# EAGLE design rak833-hat (EAGLE 9.0.1)
PROJECT_AUTHOR: XOSE PEREZ <xose.perez@gmail.com>; PROJECT_LICENSE: CC-SA-BY 4.0; PROJECT_NAME: RAK833 HAT; PROJECT_VERSION: 0.2.20180703
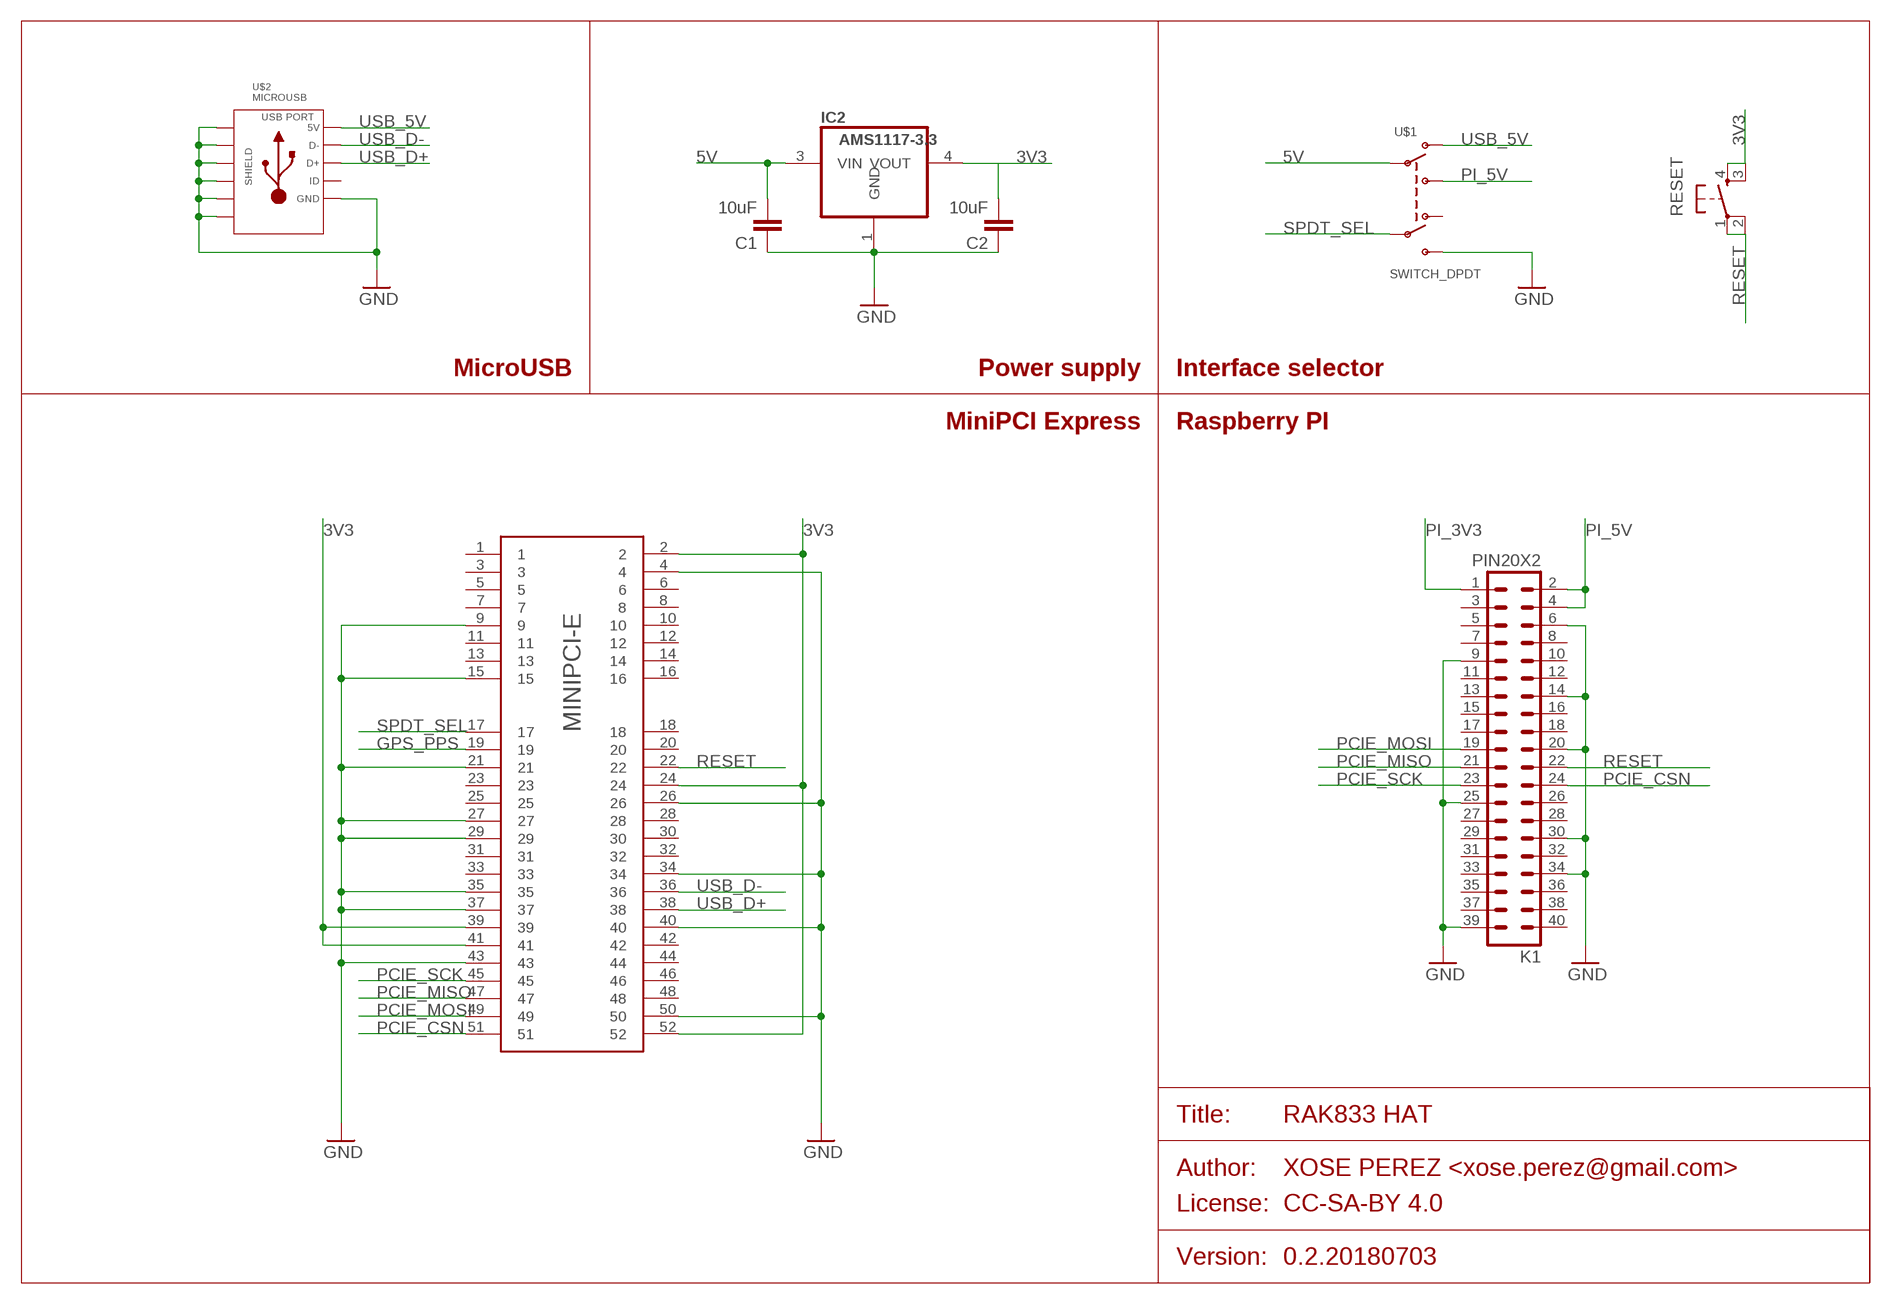
[diagram p0: schematic, sheet 1]

## Parts
C1  10uF  C-EU0805  [0805]
C2  10uF  C-EU0805  [0805]
IC2  AMS1117-3.3  REG1117SOT223-2  [SOT223]
K1  PIN20X2  [PIN_20X2]
MINIPCI-E  MINI-PCIE-RAW  [67910-MINI-PCIE]
RESET  TACTILE_BUTTON_SMD  [TACTILE-BUTTON-SMD]
U$1  SWITCH_DPDT  [SWITCH_DPDT_SMD]
U$2  MICROUSB  [MICROUSB-MOLEX-47346-0001]

## Nets
3V3: C2.2 IC2.4(VOUT) MINIPCI-E.2 MINIPCI-E.24 MINIPCI-E.39 MINIPCI-E.41 MINIPCI-E.52 RESET.3(SWB2) RESET.4(SWA2)
5V: C1.2 IC2.3(VIN) U$1.A1(P1)
GND: C1.1 C2.1 IC2.1(GND) K1.6 K1.9 K1.14 K1.20 K1.25 K1.30 K1.34 K1.39 MINIPCI-E.4 MINIPCI-E.9 MINIPCI-E.15 MINIPCI-E.21 MINIPCI-E.26 MINIPCI-E.27 MINIPCI-E.29 MINIPCI-E.34 MINIPCI-E.35 MINIPCI-E.37 MINIPCI-E.40 MINIPCI-E.43 MINIPCI-E.50 U$1.C2(S2) U$2.GND U$2.SLD1 U$2.SLD2 U$2.SLD3 U$2.SLD4 U$2.SLD5 U$2.SLD6
GPS_PPS: MINIPCI-E.19
PCIE_CSN: K1.24 MINIPCI-E.51
PCIE_MISO: K1.21 MINIPCI-E.47
PCIE_MOSI: K1.19 MINIPCI-E.49
PCIE_SCK: K1.23 MINIPCI-E.45
PI_3V3: K1.1
PI_5V: K1.2 K1.4 U$1.C1(S1)
RESET: K1.22 MINIPCI-E.22 RESET.1(SWA1) RESET.2(SWB1)
SPDT_SEL: MINIPCI-E.17 U$1.A2(P2)
USB_5V: U$1.B1(O1) U$2.VCC(5V)
USB_D+: MINIPCI-E.38 U$2.D+
USB_D-: MINIPCI-E.36 U$2.D-
Unconnected: K1.3 K1.5 K1.7 K1.8 K1.10 K1.11 K1.12 K1.13 K1.15 K1.16 K1.17 K1.18 K1.26 K1.27 K1.28 K1.29 K1.31 K1.32 K1.33 K1.35 K1.36 K1.37 K1.38 K1.40 MINIPCI-E.1 MINIPCI-E.3 MINIPCI-E.5 MINIPCI-E.6 MINIPCI-E.7 MINIPCI-E.8 MINIPCI-E.10 MINIPCI-E.11 MINIPCI-E.12 MINIPCI-E.13 MINIPCI-E.14 MINIPCI-E.16 MINIPCI-E.18 MINIPCI-E.20 MINIPCI-E.23 MINIPCI-E.25 MINIPCI-E.28 MINIPCI-E.30 MINIPCI-E.31 MINIPCI-E.32 MINIPCI-E.33 MINIPCI-E.42 MINIPCI-E.44 MINIPCI-E.46 MINIPCI-E.48 U$1.B2(O2) U$2.ID

## Notes on the sheet
- MicroUSB | Power supply | Interface selector
- MiniPCI Express | Raspberry PI

## Library data of the parts
C1 C2 = xose:C-EU: CAPACITOR, European symbol
IC2 = xose:REG1117: 800mA and 1A Low Dropout (LDO) Positive Regulator 1.8V, 2.5V, 2.85V, 3.3V, 5V, and Adj
K1 = FLYFISH:PIN20X2
MINIPCI-E = jt-con-molex:MINI-PCIE: Mini PCI-E card
RESET = xose:TACTILE_BUTTON: Tactile Button SparkFun Electronics' Tactile Button COM-10302
U$1 = xose:SWITCH_DPDT
U$2 = xose:MICROUSB

## Board
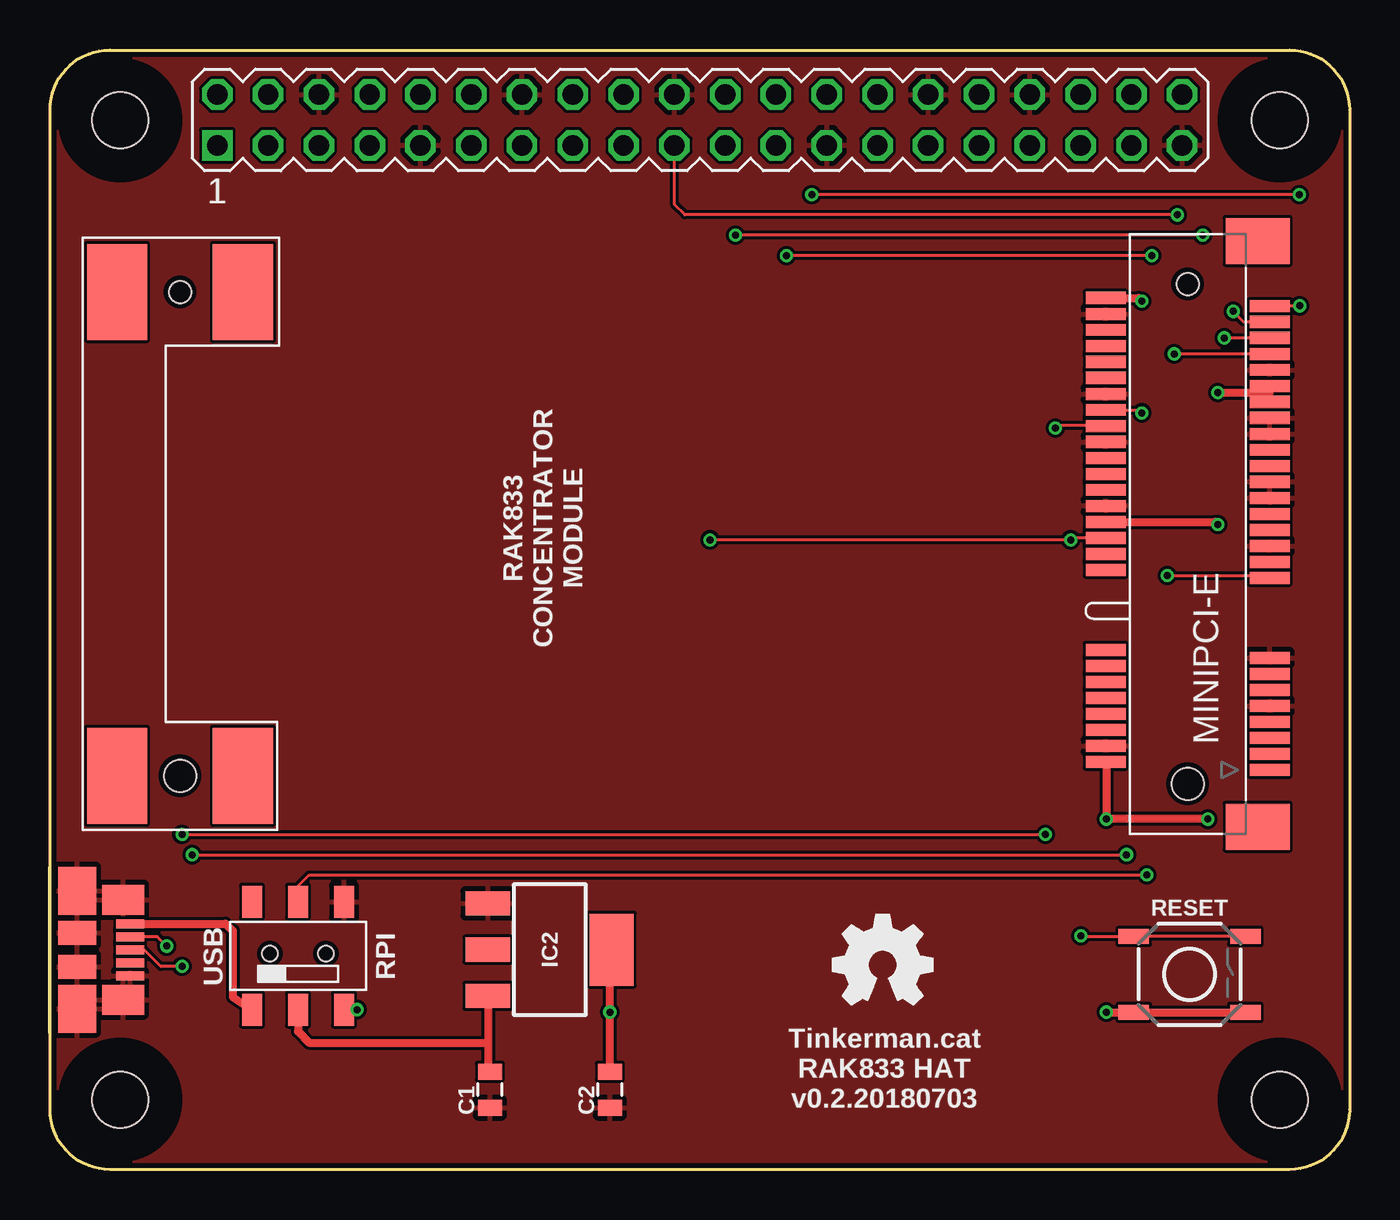
[diagram p1: board, top side]
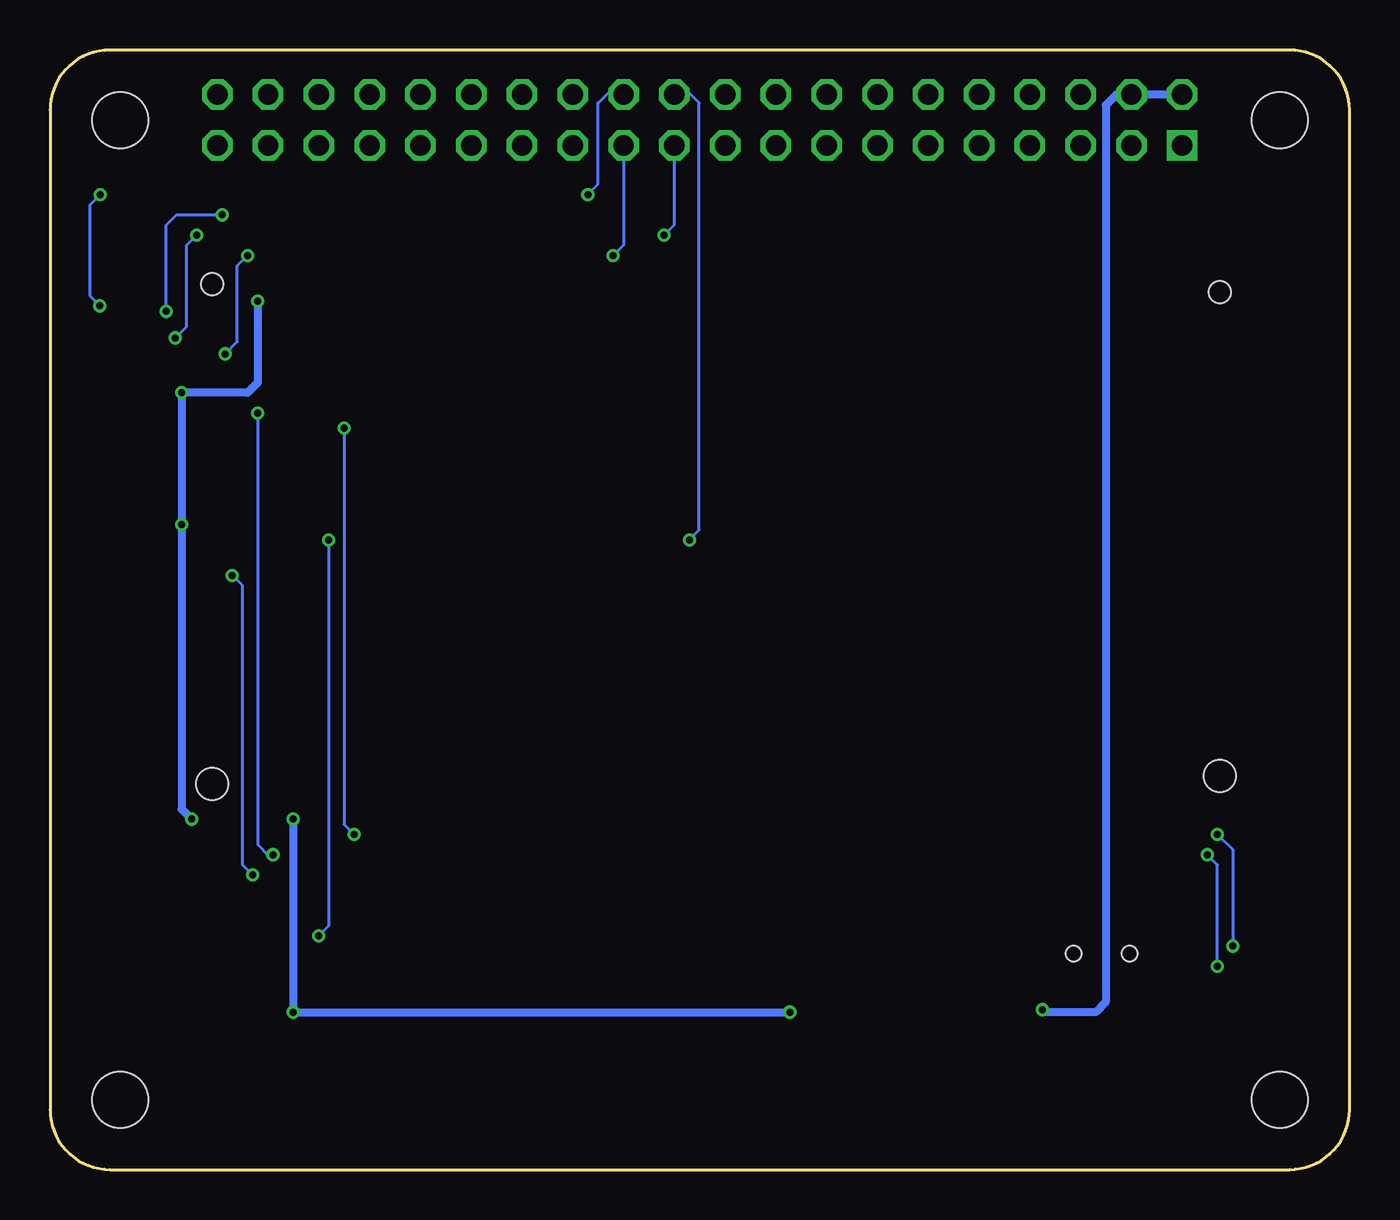
[diagram p2: board, bottom side, seen from below]

Size 65 x 56 mm. Coordinates in mm from the lower left corner, seen from the top.
Outline: 0,3 0,53 arc-90 3,56 62,56 arc-90 65,53 65,3 arc-90 62,0 3,0 arc-90 0,3
Copper layers (1*16): Top 0.035mm / dielectric 1.5mm / Bottom 0.035mm
Design rules "seedstudio-2layer": minimum track width 6mil, minimum drill 12mil, track to track 6mil, track to pad 6mil, pad to pad 6mil, via to via 6mil, smd to smd 0mil, copper to edge 10mil, drill to drill 10mil, minimum pad ring 10mil, minimum via ring 6mil, stop-mask expansion 2mil, vias tented up to drill 100mil, thermal gap 10mil
Holes 2.8 mm at 3.5,3.5 3.5,52.5 61.5,52.5 61.5,3.5
tRestrict: area 1.9,51 to 5,54; area 60,51 to 63,54; area 60,1.9 to 63,5; area 1.9,1.9 to 5,5
bRestrict: area 1.9,1.9 to 5,5; area 1.9,51 to 5,54; area 60,1.9 to 63,5; area 60,51 to 63,54

### Footprints (pad centres in the part's own frame; a part is rotated, then mirrored left to right if it is on the bottom)
0805 = smd 0.8 x 1.2: 1 -0.9,0; 2 0.9,0
SOT223 = smd 1.219 x 2.235: 1 -2.311,-3.099; 2 0,-3.099; 3 2.311,-3.099 | smd 3.6 x 2.2: 4 0,3.099
PIN_20X2 = drill 1.016 square: 1 -24.13,-1.27 | drill 1.016 octagon: 2 -24.13,1.27; 3 -21.59,-1.27; 4 -21.59,1.27; 5 -19.05,-1.27; 6 -19.05,1.27; 7 -16.51,-1.27; 8 -16.51,1.27; 9 -13.97,-1.27; 10 -13.97,1.27; 11 -11.43,-1.27; 12 -11.43,1.27; 13 -8.89,-1.27; 14 -8.89,1.27; 15 -6.35,-1.27; 16 -6.35,1.27; 17 -3.81,-1.27; 18 -3.81,1.27; 19 -1.27,-1.27; 20 -1.27,1.27; 21 1.27,-1.27; 22 1.27,1.27; 23 3.81,-1.27; 24 3.81,1.27; 25 6.35,-1.27; 26 6.35,1.27; 27 8.89,-1.27; 28 8.89,1.27; 29 11.43,-1.27; 30 11.43,1.27; 31 13.97,-1.27; 32 13.97,1.27; 33 16.51,-1.27; 34 16.51,1.27; 35 19.05,-1.27; 36 19.05,1.27; 37 21.59,-1.27; 38 21.59,1.27; 39 24.13,-1.27; 40 24.13,1.27
67910-MINI-PCIE = smd 0.6 x 2: 1 0,0; 2 0.4,8.2; 3 0.8,0; 4 1.2,8.2; 5 1.6,0; 6 2,8.2; 7 2.4,0; 8 2.8,8.2; 9 3.2,0; 10 3.6,8.2; 11 4,0; 12 4.4,8.2; 13 4.8,0; 14 5.2,8.2; 15 5.6,0; 16 6,8.2; 17 9.6,0; 18 10,8.2; 19 10.4,0; 20 10.8,8.2; 21 11.2,0; 22 11.6,8.2; 23 12,0; 24 12.4,8.2; 25 12.8,0; 26 13.2,8.2; 27 13.6,0; 28 14,8.2; 29 14.4,0; 30 14.8,8.2; 31 15.2,0; 32 15.6,8.2; 33 16,0; 34 16.4,8.2; 35 16.8,0; 36 17.2,8.2; 37 17.6,0; 38 18,8.2; 39 18.4,0; 40 18.8,8.2; 41 19.2,0; 42 19.6,8.2; 43 20,0; 44 20.4,8.2; 45 20.8,0; 46 21.2,8.2; 47 21.6,0; 48 22,8.2; 49 22.4,0; 50 22.8,8.2; 51 23.2,0; 52 23.6,8.2 | smd 2.3 x 3.2: C1 -2.85,0.6; C2 26.45,0.6 | smd 4.8 x 3: D1 -0.3,57.65; D2 -0.3,51.35; D3 23.9,51.35; D4 23.9,57.65 | hole 1.6: -0.7,4.1; -0.3,54.5 | hole 1.1: 24.3,4.1; 23.9,54.5
TACTILE-BUTTON-SMD = smd 1.524 x 0.762: 1 -2.794,1.905; 2 2.794,1.905; 3 -2.794,-1.905; 4 2.794,-1.905
SWITCH_DPDT_SMD = smd 1 x 1.6: A1 3.4,-1; A2 3.4,4.4; B1 1.1,-1; B2 1.1,4.4; C1 5.7,-1; C2 5.7,4.4 | hole 0.762: 2,1.8; 4.8,1.8
MICROUSB-MOLEX-47346-0001 = smd 1.4 x 0.45: D+ 0,0; D- 0,0.65; GND 0,-1.3; ID 0,-0.65; VCC 0,1.3 | smd 2.1 x 1.5: SLD1 -0.35,-2.5; SLD2 -0.35,2.5 | smd 1.9 x 2.4: SLD3 -2.65,-2.95; SLD6 -2.65,2.95 | smd 1.9 x 1.2: SLD4 -2.65,-0.85; SLD5 -2.65,0.85

### Placement (x,y rotation side)
C1  22,4 90 top
C2  28,4 90 top
IC2  25,11 270 top
K1  32.5,52.5 0 top
MINIPCI-E  61,20 90 top
RESET  57,9.76 0 top
U$1  9,9 0 top
U$2  4,11 0 top

### Tracks (layer width: path | path; a pad name or v marks a point on that pad's centre or on a via)
3V3  (via drill 0.35)
  Top 0.305: 28,10.9 IC2.4 | RESET.3 54.36,7.86 | MINIPCI-E.39 61,38.86 MINIPCI-E.41 | MINIPCI-E.2 52.83,20.37
  Top 0.406: C2.2 v28,7.87 28,10.9 | 54.36,7.86 RESET.4 | v58.42,38.86 61,38.86 | 52.83,20.37 v52.83,17.53 v57.91,17.53 | MINIPCI-E.24 58.28,32.4 v58.42,32.26 | MINIPCI-E.52 54.44,43.6 v54.61,43.43 | v52.83,7.87 52.85,7.86 RESET.3
  Bottom 0.406: v54.61,43.43 54.61,39.37 55.12,38.86 v58.42,38.86 v58.42,32.26 58.42,18.03 v57.91,17.53 | v52.83,17.53 v52.83,7.87 v28,7.87 27.94,7.87
5V
  Top 0.305: 21.9,5 C1.2
  Top 0.406: U$1.A1 12.4,6.9 12.95,6.35 21.9,6.35 | IC2.3 21.9,6.35 | 21.9,6.35 21.9,5
GND
  pour Top: -1,57 66,57 66,-1 -1,-1
PCIE_CSN  (via drill 0.35)
  Top 0.152: MINIPCI-E.51 v62.5,43.2 | v62.48,48.77 v38.1,48.77
  Bottom 0.152: v62.5,43.2 62.99,43.69 62.99,48.26 v62.48,48.77 | v38.1,48.77 37.59,49.28 37.59,53.34 37.08,53.85 37.01,53.77 K1.24
PCIE_MISO  (via drill 0.35)
  Top 0.152: MINIPCI-E.47 v58.73,41.6 | v57.66,46.74 v34.29,46.74
  Bottom 0.152: v58.73,41.6 58.17,42.16 58.17,46.23 v57.66,46.74 | v34.29,46.74 33.77,47.26 K1.21
PCIE_MOSI  (via drill 0.35)
  Top 0.152: MINIPCI-E.49 59.71,42.4 v59.18,42.93 | K1.19 31.24,51.22 31.24,48.26 31.75,47.75 v56.39,47.75
  Bottom 0.152: v59.18,42.93 59.18,47.24 58.67,47.75 v56.39,47.75
PCIE_SCK  (via drill 0.35)
  Top 0.152: MINIPCI-E.45 v56.23,40.8 | v55.12,45.72 v36.83,45.72
  Bottom 0.152: v56.23,40.8 55.63,41.4 55.63,45.21 v55.12,45.72 | K1.23 36.31,46.24 v36.83,45.72
PI_5V  (via drill 0.35)
  Top 0.406: U$1.C1 v15.37,8
  Bottom 0.406: K1.2 K1.4 11.67,53.77 12.19,53.25 12.19,8.38 12.7,7.87 15.24,7.87 v15.37,8
RESET  (via drill 0.35)
  Top 0.152: RESET.2 RESET.1 51.58,11.67 v51.56,11.68 | MINIPCI-E.22 51.16,31.6 v51.05,31.5 v33.02,31.5
  Bottom 0.152: v51.05,31.5 51.05,12.19 v51.56,11.68 | v33.02,31.5 32.52,31.99 32.52,53.35 33.02,53.85 33.1,53.77 K1.22
SPDT_SEL  (via drill 0.35)
  Top 0.152: U$1.A2 12.4,14.18 12.95,14.73 v54.86,14.73 | v55.88,29.72 60.88,29.72
  Top 0.305: 60.88,29.72 MINIPCI-E.17
  Bottom 0.152: v54.86,14.73 55.37,15.24 55.37,29.21 v55.88,29.72
USB_5V
  Top 0.305: 10.16,8.24 U$1.B1
  Top 0.406: U$2.VCC 8.78,12.3 9.14,11.94 9.14,8.64 U$1.B1
USB_D+  (via drill 0.35)
  Top 0.152: v6.6,10.16 5.55,10.16 4.71,11 U$2.D+ | v7.11,15.75 v53.85,15.75 | MINIPCI-E.38 54.46,38 v54.61,37.85
  Bottom 0.152: v6.6,10.16 6.6,15.24 v7.11,15.75 | v53.85,15.75 54.1,15.75 54.61,16.26 v54.61,37.85
USB_D-  (via drill 0.35)
  Top 0.152: v5.84,11.18 5.37,11.65 U$2.D- | v6.6,16.76 v49.78,16.76 | MINIPCI-E.36 50.41,37.2 v50.29,37.08
  Bottom 0.152: v6.6,16.76 5.84,16 v5.84,11.18 | v50.29,37.08 50.29,17.27 v49.78,16.76

### Text on the board
tNames: RAK833 / CONCENTRATOR / MODULE | USB | RPI | Tinkerman.cat / RAK833 HAT / v0.2.20180703